# EAGLE design ultrasound (EAGLE 9.2.2)
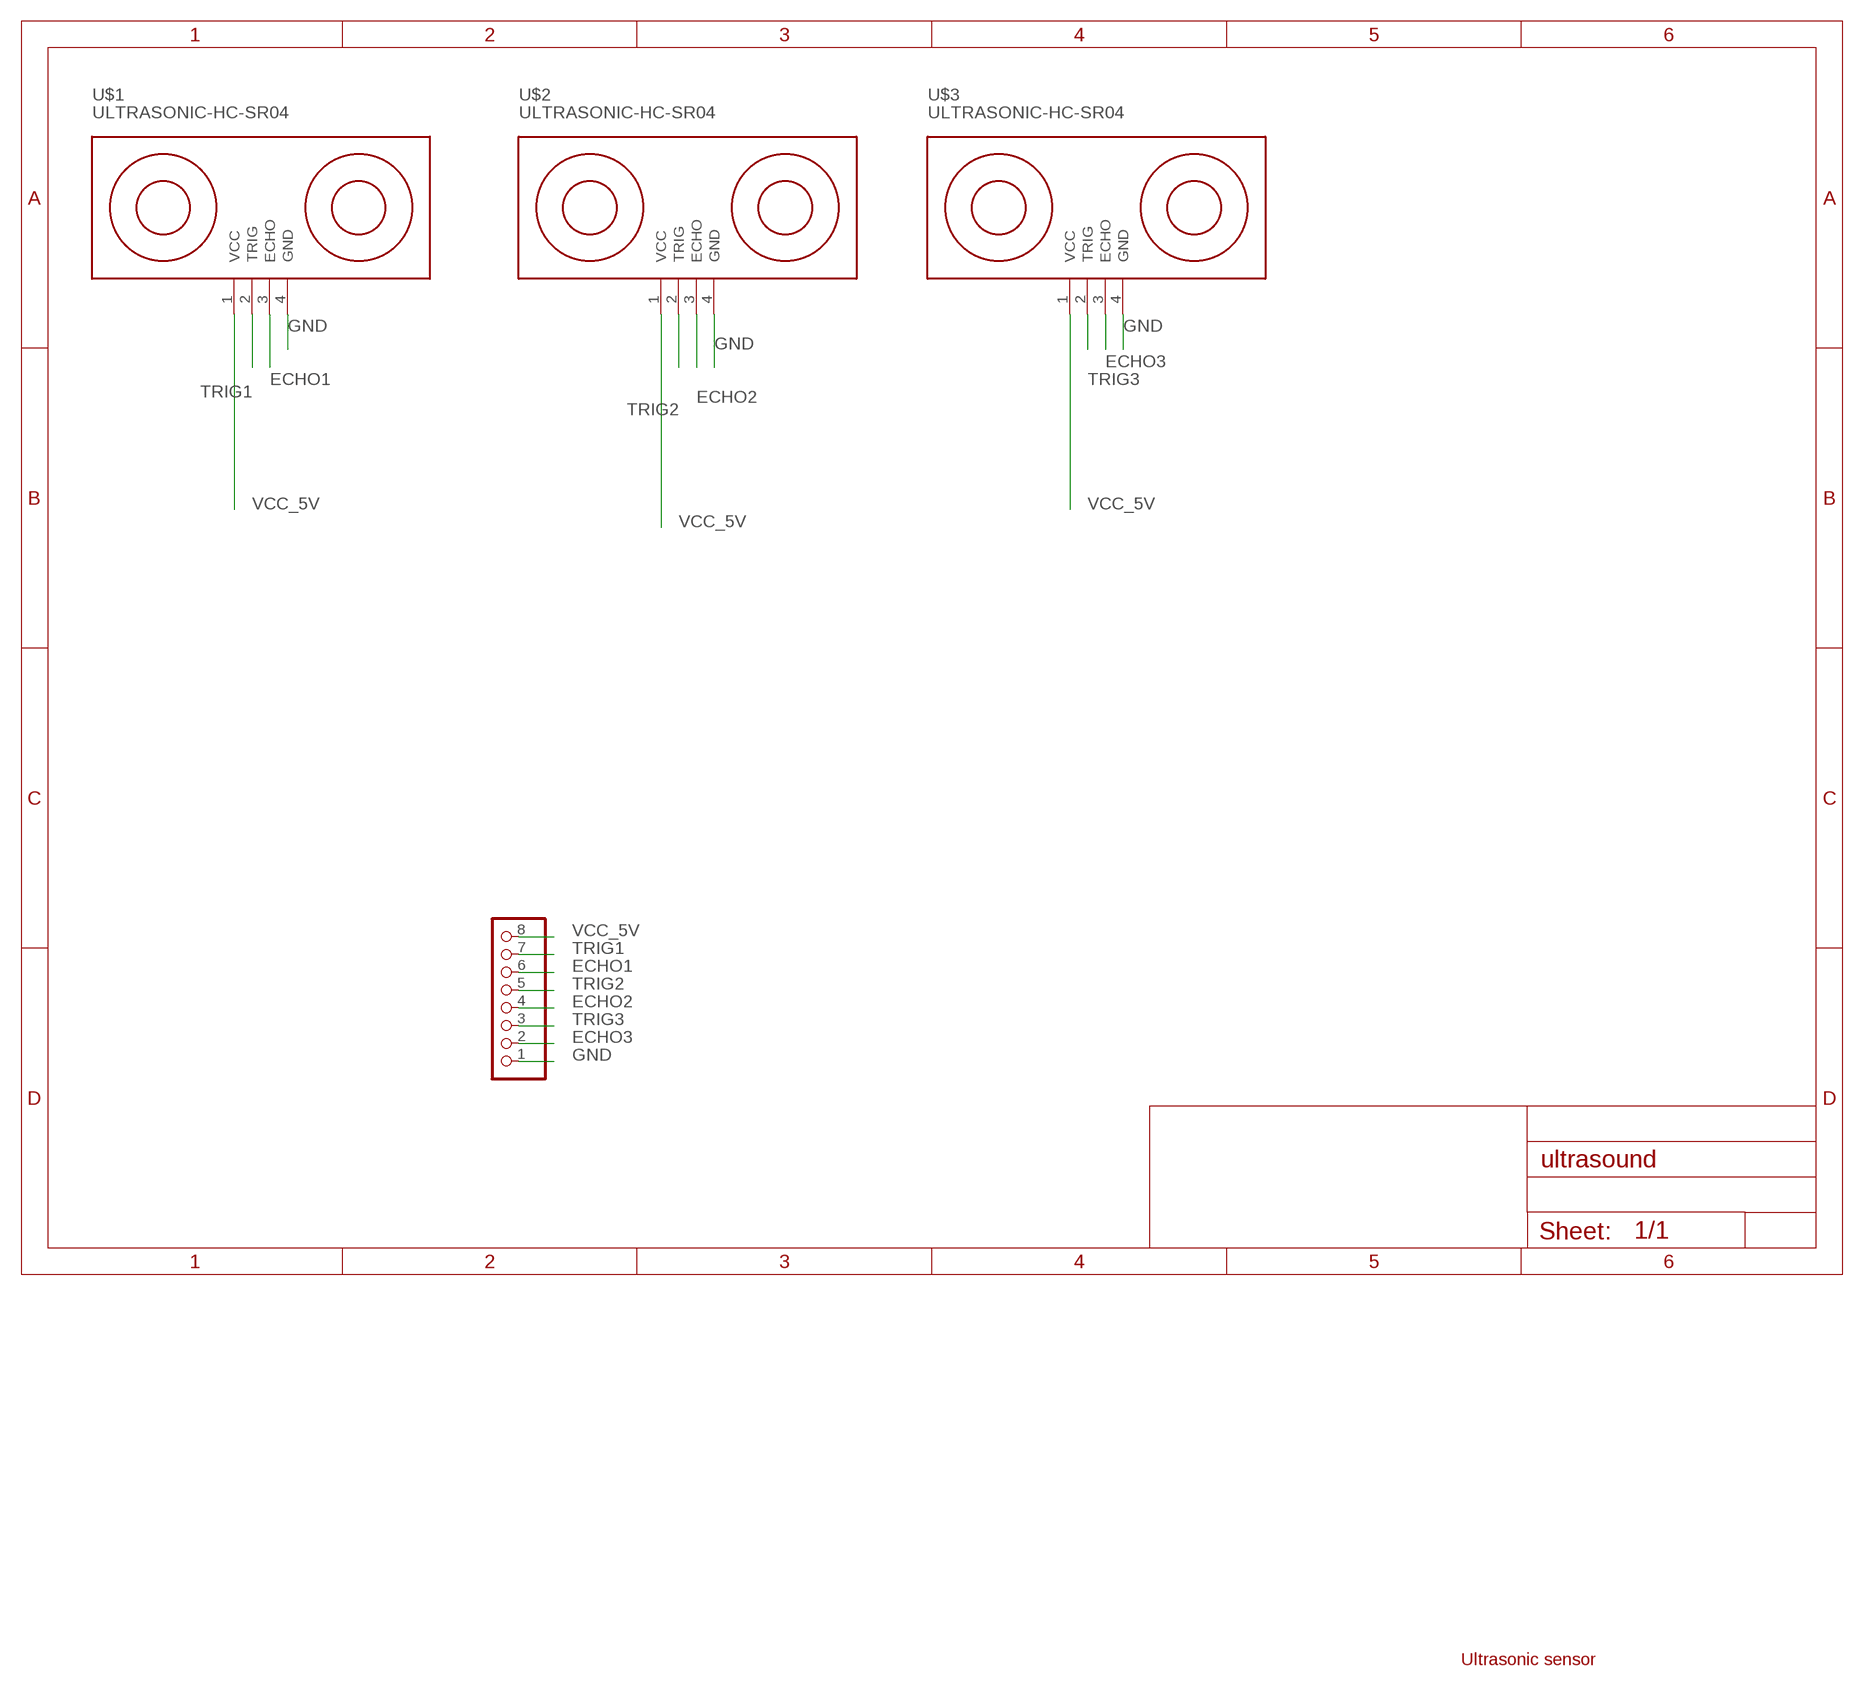
[diagram p0: schematic, sheet 1]

## Parts
JP2  PINHD-1X8/90  [1X08/90]
U$1  ULTRASONIC-HC-SR04  [ULTRASONIC-HC-SR04]
U$2  ULTRASONIC-HC-SR04  [ULTRASONIC-HC-SR04]
U$3  ULTRASONIC-HC-SR04  [ULTRASONIC-HC-SR04]

## Nets
ECHO1: JP2.6 U$1.3(ECHO)
ECHO2: JP2.4 U$2.3(ECHO)
ECHO3: JP2.2 U$3.3(ECHO)
GND: JP2.1 U$1.4(GND) U$2.4(GND) U$3.4(GND)
TRIG1: JP2.7 U$1.2(TRIG)
TRIG2: JP2.5 U$2.2(TRIG)
TRIG3: JP2.3 U$3.2(TRIG)
VCC_5V: JP2.8 U$1.1(VCC) U$2.1(VCC) U$3.1(VCC)

## Notes on the sheet
- Ultrasonic sensor

## Library data of the parts
JP2 = pinhead:PINHD-1X8: PIN HEADER
U$1-U$3 = diy-modules:ULTRASONIC-HC-SR04: Ultrasonic Ranging Module HC-SR04 More details available here: http://randomnerdtutorials.com/complete-guide-for-ultrasonic-sensor-hc-sr04/ Click here to find device on ebay.com <http://www.ebay.com/sch/hc+sr04+ultrasonic>

## Board
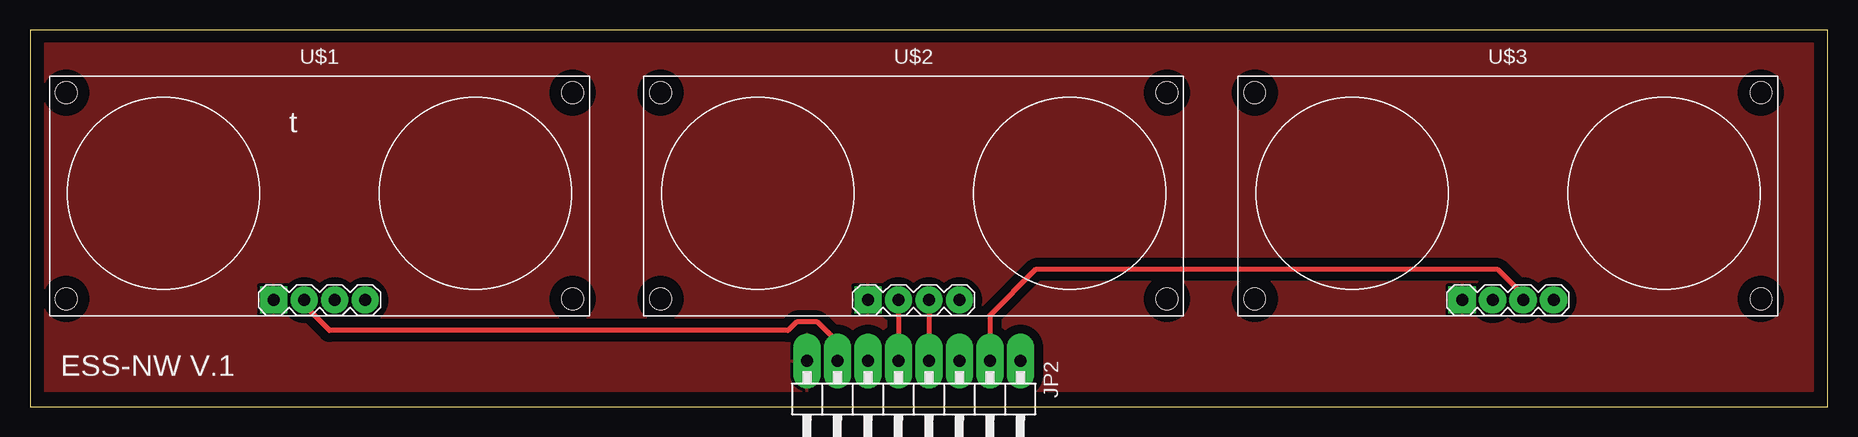
[diagram p1: board, top side]
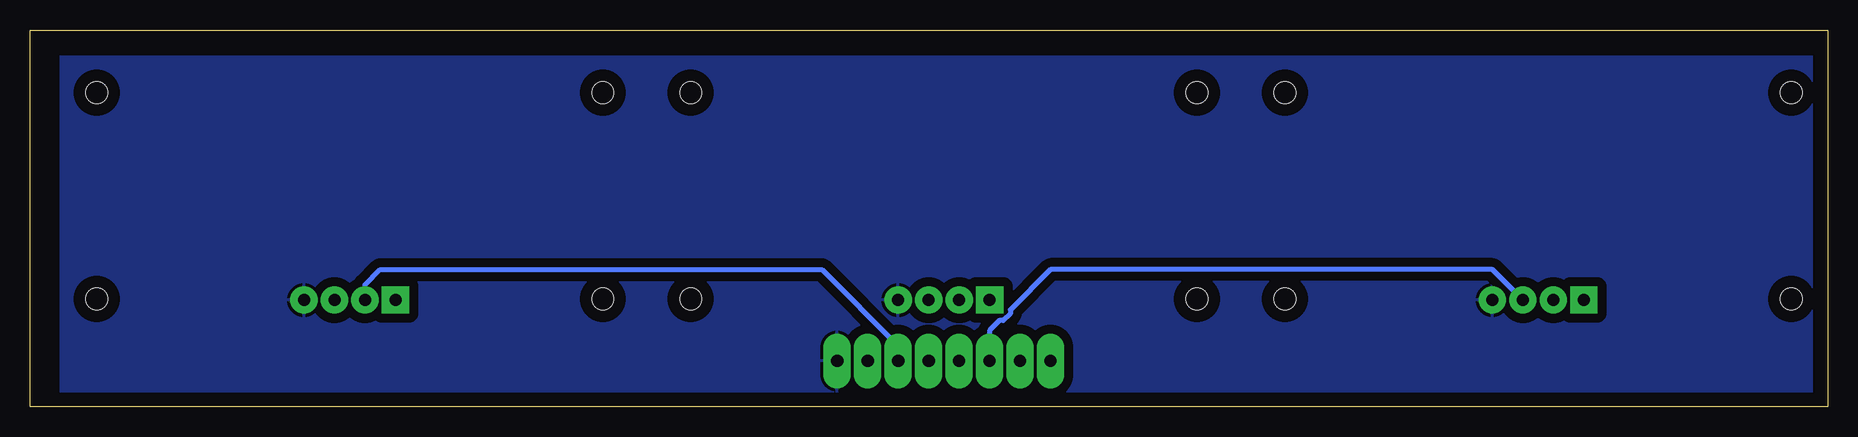
[diagram p2: board, bottom side, seen from below]

Size 149.84 x 31.42 mm. Coordinates in mm from the lower left corner, seen from the top.
Outline: 0,0 149.84,0 149.84,31.42 0,31.42 0,0
Copper layers (1*16): Top 0.035mm / dielectric 1.5mm / Bottom 0.035mm
Design rules "default *": minimum track width 6mil, minimum drill 0.35mm, track to track 30mil, track to pad 30mil, pad to pad 30mil, via to via 30mil, smd to smd 6mil, copper to edge 40mil, drill to drill 6mil, minimum pad ring 25mil, minimum via ring 8mil, stop-mask expansion 4mil, vias tented up to drill 0mil, thermal gap 10mil

### Footprints (pad centres in the part's own frame; a part is rotated, then mirrored left to right if it is on the bottom)
1X08/90 = drill 1.016 long: 1 -8.89,-3.81; 2 -6.35,-3.81; 3 -3.81,-3.81; 4 -1.27,-3.81; 5 1.27,-3.81; 6 3.81,-3.81; 7 6.35,-3.81; 8 8.89,-3.81
ULTRASONIC-HC-SR04 = drill 1 square: 1 -3.81,-8.89 | drill 1: 2 -1.27,-8.89; 3 1.27,-8.89; 4 3.81,-8.89 | hole 1.8: -21.1,8.4; -21.1,-8.8; 21.1,-8.8; 21.1,8.4

### Placement (x,y rotation side)
JP2  73.66,0 180 top
U$1  24.13,17.78 0 top
U$2  73.66,17.78 0 top
U$3  123.19,17.78 0 top

### Tracks (layer width: path | path; a pad name or v marks a point on that pad's centre or on a via)
ECHO1
  Bottom 0.406: U$1.3 27.94,11.43 64.77,11.43 68.13,8.07 68.13,7.74 68.7,7.17 69.03,7.17 69.85,6.35 JP2.6
ECHO2
  Top 0.406: U$2.3 JP2.4
ECHO3
  Top 0.406: U$3.3 124.02,9.33 124.02,9.76 122.35,11.43 83.82,11.43 80.01,7.62 JP2.2
GND
  pour Bottom: 1.27,29.21 147.32,29.21 147.32,1.27 1.27,1.27
TRIG1
  Top 0.406: JP2.7 66.88,4.24 66.88,5.83 65.64,7.06 63.9,7.06 63.19,6.35 24.97,6.35 23.3,8.02 23.3,8.45 U$1.2
TRIG2
  Top 0.406: U$2.2 JP2.5
TRIG3
  Bottom 0.406: U$3.2 121.92,10.16 120.65,11.43 83.82,11.43 77.47,5.08 JP2.3
VCC_5V
  pour Top: 1.27,30.48 148.59,30.48 148.59,1.27 1.27,1.27

### Text on the board
tNames: t | ESS-NW V.1